# EAGLE design NESv2 (EAGLE 5.11)
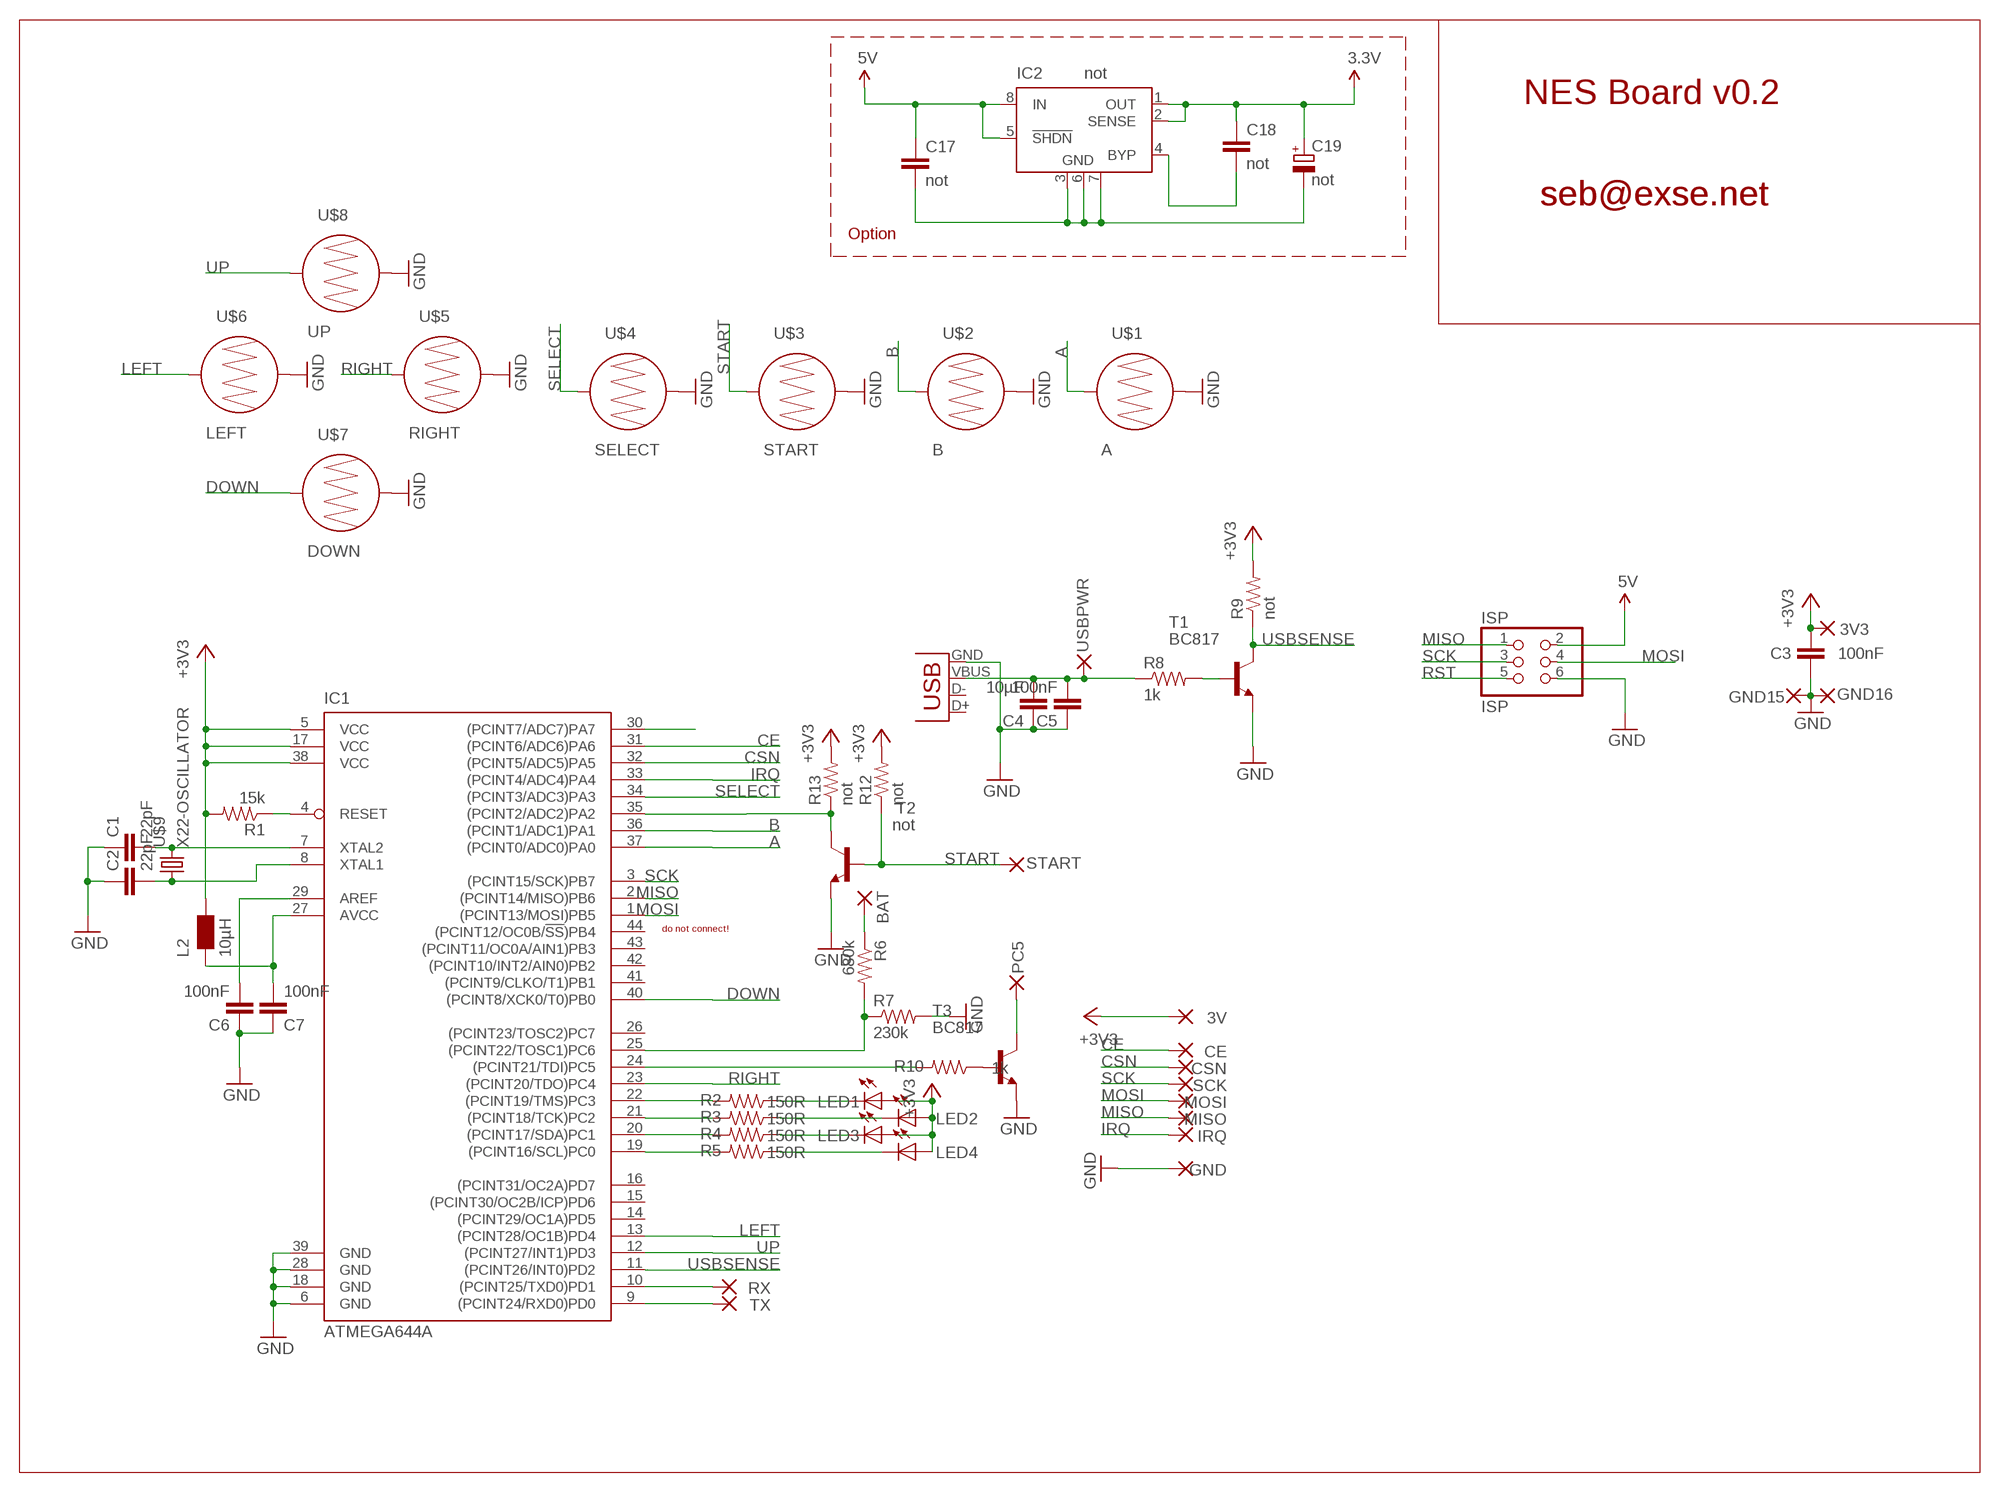
[diagram p0: schematic, sheet 1]

## Parts
3V  SMD2  [SMD1,27-2,54]
3V3  SMD2  [SMD1,27-2,54]
BAT  SMD2  [SMD1,27-2,54]
C1  22pF  CAP0805  [0805]
C2  22pF  CAP0805  [0805]
C3  100nF  CAP0805  [0805]
C4  10µF  CAP0805  [0805]
C5  100nF  CAP0805  [0805]
C6  100nF  CAP0805  [0805]
C7  100nF  CAP0805  [0805]
C17  not  CAP0805  [0805]
C18  not  CAP0805  [0805]
C19  not  CPOL-EUSMCC  [SMC_C]
CE  SMD2  [SMD1,27-2,54]
CSN  SMD2  [SMD1,27-2,54]
GND  SMD2  [SMD1,27-2,54]
GND15  SMD2  [SMD1,27-2,54]
GND16  SMD2  [SMD1,27-2,54]
IC1  ATMEGA644A  [TQFP44]
IC2  not  LT1763CS8-3.3  [SOIC8]
IRQ  SMD2  [SMD1,27-2,54]
ISP  ISP  PINHD-2X03_2.54  [2X03]
L2  10µH  WE-KIHQ_0805  [WE-KI_0805_B]
LED1  LED3MM  [LED3MM]
LED2  LED3MM  [LED3MM]
LED3  LED3MM  [LED3MM]
LED4  LED3MM  [LED3MM]
MISO  SMD2  [SMD1,27-2,54]
MOSI  SMD2  [SMD1,27-2,54]
PC5  SMD2  [SMD1,27-2,54]
R1  15k  RESISTOR  [0805]
R2  150R  RESISTOR  [0805]
R3  150R  RESISTOR  [0805]
R4  150R  RESISTOR  [0805]
R5  150R  RESISTOR  [0805]
R6  680k  RESISTOR  [0805]
R7  230k  RESISTOR  [0805]
R8  1k  RESISTOR  [0805]
R9  not  RESISTOR  [0805]
R10  1k  RESISTOR  [0805]
R12  not  RESISTOR  [0805]
R13  not  RESISTOR  [0805]
RX  SMD2  [SMD1,27-2,54]
SCK  SMD2  [SMD1,27-2,54]
START  SMD2  [SMD1,27-2,54]
T1  BC817  BC847  [SOT23]
T2  not  BC847  [SOT23]
T3  BC817  BC847  [SOT23]
TX  SMD2  [SMD1,27-2,54]
U$1  A  BUTTON-CONDUCTIVESMD  [BUTTON-CONDUCTIVE]
U$2  B  BUTTON-CONDUCTIVESMD  [BUTTON-CONDUCTIVE]
U$3  START  BUTTON-CONDUCTIVESMD  [BUTTON-CONDUCTIVE]
U$4  SELECT  BUTTON-CONDUCTIVESMD  [BUTTON-CONDUCTIVE]
U$5  RIGHT  BUTTON-CONDUCTIVESMD  [BUTTON-CONDUCTIVE]
U$6  LEFT  BUTTON-CONDUCTIVESMD  [BUTTON-CONDUCTIVE]
U$7  DOWN  BUTTON-CONDUCTIVESMD  [BUTTON-CONDUCTIVE]
U$8  UP  BUTTON-CONDUCTIVESMD  [BUTTON-CONDUCTIVE]
U$9  X22-OSCILLATOR  [X22]
USBPWR  SMD2  [SMD1,27-2,54]
X1  USB-SMD-NS  [USB-MINIB-NOSTOP]

## Nets
3.3V: C18.1 C19.+ IC2.1(OUT) IC2.2(SENSE)
5V: C17.1 IC2.5(!SHDN) IC2.8(IN) ISP.2
+3V3: 3V3.1(P) 3V.1(P) C3.1 IC1.5(VCC) IC1.17(VCC) IC1.38(VCC) L2.1 LED1.A LED2.A LED3.A LED4.A R1.2 R9.2 R12.2 R13.2
+5V: C4.2 C5.2 R8.1 USBPWR.1(P) X1.VBUS
A: IC1.37((PCINT0/ADC0)PA0) U$1.1
B: IC1.36((PCINT1/ADC1)PA1) U$2.1
CE: CE.1(P) IC1.31((PCINT6/ADC6)PA6)
CSN: CSN.1(P) IC1.32((PCINT5/ADC5)PA5)
DOWN: IC1.40((PCINT8/XCK0/T0)PB0) U$7.1
GND: C1.1 C2.1 C3.2 C4.1 C5.1 C6.2 C7.2 C17.2 C19.- GND15.1(P) GND16.1(P) GND.1(P) IC1.6(GND) IC1.18(GND) IC1.28(GND) IC1.39(GND) IC2.3(GND) IC2.6(GND) IC2.7(GND) ISP.6 R7.2 T1.2(E) T2.2(E) T3.2(E) U$1.2 U$2.2 U$3.2 U$4.2 U$5.2 U$6.2 U$7.2 U$8.2 X1.GND
IRQ: IC1.33((PCINT4/ADC4)PA4) IRQ.1(P)
LEFT: IC1.13((PCINT28/OC1B)PD4) U$6.1
MISO: IC1.2((PCINT14/MISO)PB6) ISP.1 MISO.1(P)
MOSI: IC1.1((PCINT13/MOSI)PB5) ISP.4 MOSI.1(P)
N$1: R10.1 T3.1(B)
N$2: C2.2 IC1.8(XTAL1) U$9.1
N$3: C1.2 IC1.7(XTAL2) U$9.3
N$4: IC1.19((PCINT16/SCL)PC0) R5.2
N$5: IC1.20((PCINT17/SDA)PC1) R4.2
N$6: IC1.21((PCINT18/TCK)PC2) R3.2
N$7: IC1.22((PCINT19/TMS)PC3) R2.2
N$8: LED1.K(C) R2.1
N$9: LED2.K(C) R3.1
N$10: LED3.K(C) R4.1
N$11: LED4.K(C) R5.1
N$12: IC1.24((PCINT21/TDI)PC5) R10.2
N$13: C7.1 IC1.27(AVCC) L2.2
N$14: IC1.9((PCINT24/RXD0)PD0) TX.1(P)
N$15: IC1.10((PCINT25/TXD0)PD1) RX.1(P)
N$16: BAT.1(P) R6.1
N$17: IC1.25((PCINT22/TOSC1)PC6) R6.2 R7.1
N$18: R8.2 T1.1(B)
N$19: C18.2 IC2.4(BYP)
N$20: C6.1 IC1.29(AREF)
N$21: IC1.35((PCINT2/ADC2)PA2) R13.1 T2.3(C)
N$22: IC1.30((PCINT7/ADC7)PA7)
PC5: PC5.1(P) T3.3(C)
RIGHT: IC1.23((PCINT20/TDO)PC4) U$5.1
RST: IC1.4(RESET) ISP.5 R1.1
SCK: IC1.3((PCINT15/SCK)PB7) ISP.3 SCK.1(P)
SELECT: IC1.34((PCINT3/ADC3)PA3) U$4.1
START: R12.1 START.1(P) T2.1(B) U$3.1
UP: IC1.12((PCINT27/INT1)PD3) U$8.1
USBSENSE: IC1.11((PCINT26/INT0)PD2) R9.1 T1.3(C)
Unconnected: IC1.14((PCINT29/OC1A)PD5) IC1.15((PCINT30/OC2B/ICP)PD6) IC1.16((PCINT31/OC2A)PD7) IC1.26((PCINT23/TOSC2)PC7) IC1.41((PCINT9/CLKO/T1)PB1) IC1.42((PCINT10/INT2/AIN0)PB2) IC1.43((PCINT11/OC0A/AIN1)PB3) IC1.44((PCINT12/OC0B/!SS!)PB4) X1.D+ X1.D-

## Notes on the sheet
- NES Board v0.2
- seb@exse.net | seb@exse.net
- Option
- do not connect!

## Library data of the parts
3V 3V3 BAT CE CSN GND GND15 GND16 IRQ MISO MOSI PC5 RX SCK START TX USBPWR = wirepad:SMD2: SMD PAD
C1-C7 C17 C18 = SparkFun:CAP: Capacitor Standard 0603 ceramic capacitor, and 0.1" leaded capacitor.
C19 = resistor:CPOL-EU: POLARIZED CAPACITOR, European symbol
IC1 = atmel:ATMEGA644: 8-bit Microcontroller with 64K Bytes In-System Programmable Flash Source: http://www.atmel.com/dyn/resources/prod_documents/doc2593.pdf; MPN: ATMEGA644PV-10AU; OC_FARNELL: 1455123; OC_NEWARK: 58M3748
IC2 = linear-technology:LT1763CS8: 500mA, Low Noise, LDO Micropower Regulators Source: http://cds.linear.com/docs/Datasheet/1763ff.pdf
ISP = pinhead-2:PINHD-2X03: PIN HEADER
L2 = wuerth-elektronik:WE-KIHQ: SMD Wire Wound Ceramic Inductor WE-KIHQ - High current - Highest Quality factor in size 0805 - up to 98 - High thermal stability - High SRF -- Bluetooth -- Wireless LAN -- RF oscillation circuit -- IF impedance matching -- IG choke
LED1-LED4 = SparkFun:LED: LEDs Standard schematic elements and footprints for 5mm, 3mm, 1206, and 0603 sized LEDs. 5mm - Spark Fun Electronics SKU : COM-00529 (and others)
R1-R10 R12 R13 = SparkFun:RESISTOR: Resistor Basic schematic elements and footprints for 0603, 1206, and PTH 1/10th watt (small) resistors.
T1-T3 = transistor:BC847: NPN TRANSISTOR
U$1-U$8 = SparkFun:BUTTON-CONDUCTIVE: Conductive Button Used with rubber key pads. This one was designed and proven to work with the PolyCase Key FOB enclosures.
U$9 = seb:X22-OSCILLATOR
X1 = SparkFun:USB: USB Connectors USB-B-PTH is fully proven SKU : PRT-00139 USB-miniB is fully proven SKU : PRT-00587 USB-A-PCB is untested. USB-A-H is throughly reviewed, but untested. Spark Fun Electronics SKU : PRT-00437 USB-B-SMT is throughly reviewed, but untested. Needs silkscreen touching up. USB-A-S has not been used/tested USB-MB-H has not been used/tested

## Board
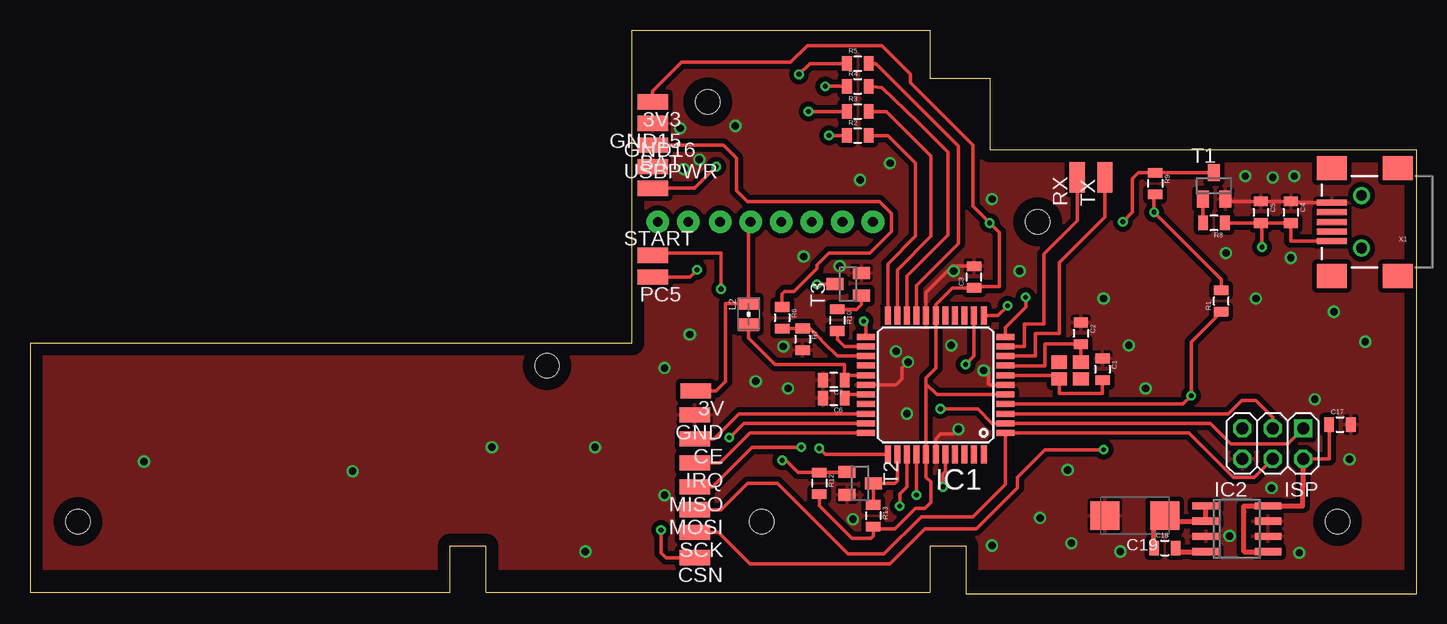
[diagram p1: board, top side]
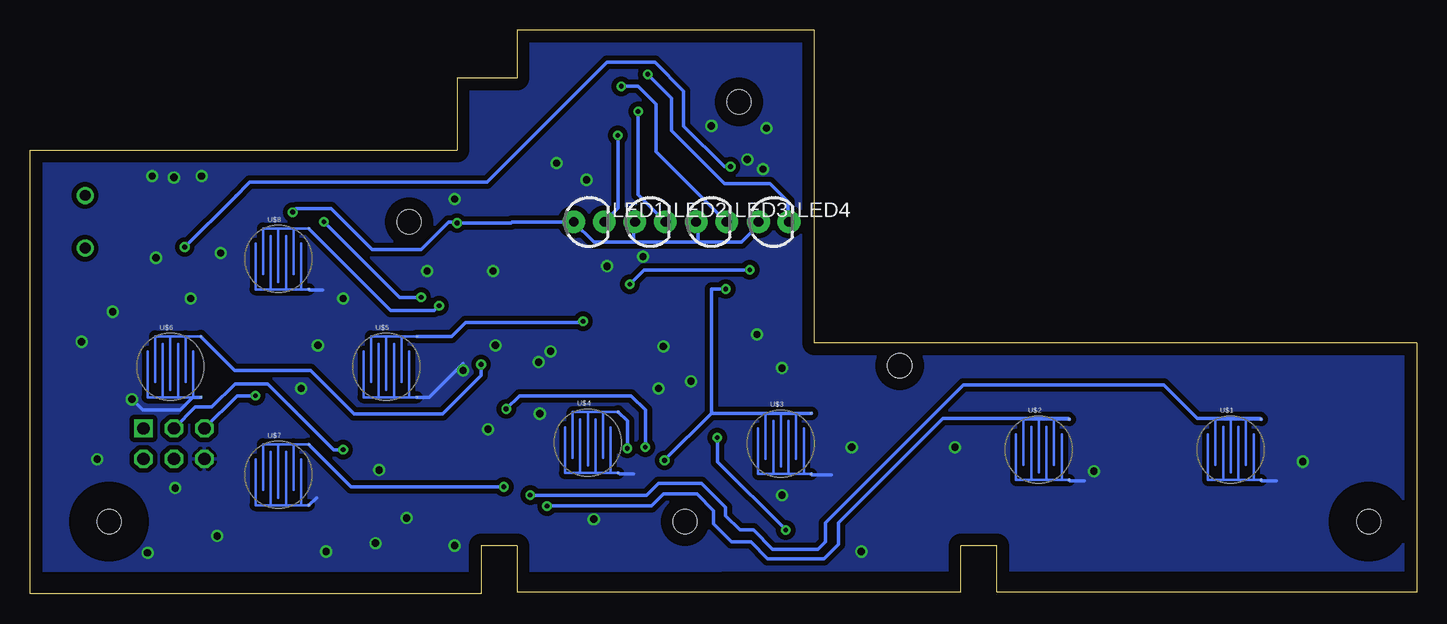
[diagram p2: board, bottom side, seen from below]

Size 115.6 x 47 mm. Coordinates in mm from the lower left corner, seen from the top.
Outline: 0,0.1 35,0.1 35,4 38,4 38,0.1 75,0.1 75,4 78,4 78,0 115.6,0 115.6,37 80,37 80,43 75,43 75,47 50.2,47 50.2,20.9 0,20.9 0,0.1
Copper layers (1*16): Top 0.035mm / dielectric 1.5mm / Bottom 0.035mm
Design rules "default *": minimum track width 10mil, minimum drill 0.3mm, track to track 8mil, track to pad 8mil, pad to pad 8mil, via to via 8mil, smd to smd 8mil, copper to edge 40mil, drill to drill 8mil, minimum pad ring 10mil, minimum via ring 8mil, stop-mask expansion 4mil, vias tented up to drill 0.6mm, thermal gap 10mil
Holes 2 mm at 4,6 61,6 109,6 56.5,41 84,31 43.1,19
tKeepout: area 91.3,15.9 to 97.3,21.9; area 19.6,11 to 25.6,17
bKeepout: area 59.6,4.6 to 62.4,7.4; area 55.1,39.6 to 57.9,42.4; area 41.7,17.7 to 44.5,20.5; area 82.4,29.5 to 85.2,32.3
tRestrict: 3 lines
bRestrict: area 107.6,4.6 to 110.4,7.4; area 2.6,4.6 to 5.4,7.4

### Footprints (pad centres in the part's own frame; a part is rotated, then mirrored left to right if it is on the bottom)
SMD1,27-2,54 = smd 1.27 x 2.54: 1 0,0
0805 = smd 0.8 x 1.2: 1 -0.9,0; 2 0.9,0
SMC_C = smd 2.4 x 2.4: + -2.5,0; - 2.5,0
TQFP44 = smd 1.5 x 0.5: 1 -5.8,4; 2 -5.8,3.2; 3 -5.8,2.4; 4 -5.8,1.6; 5 -5.8,0.8; 6 -5.8,0; 7 -5.8,-0.8; 8 -5.8,-1.6; 9 -5.8,-2.4; 10 -5.8,-3.2; 11 -5.8,-4; 23 5.8,-4; 24 5.8,-3.2; 25 5.8,-2.4; 26 5.8,-1.6; 27 5.8,-0.8; 28 5.8,0; 29 5.8,0.8; 30 5.8,1.6; 31 5.8,2.4; 32 5.8,3.2; 33 5.8,4 | smd 0.5 x 1.5: 12 -4,-5.8; 13 -3.2,-5.8; 14 -2.4,-5.8; 15 -1.6,-5.8; 16 -0.8,-5.8; 17 0,-5.8; 18 0.8,-5.8; 19 1.6,-5.8; 20 2.4,-5.8; 21 3.2,-5.8; 22 4,-5.8; 34 4,5.8; 35 3.2,5.8; 36 2.4,5.8; 37 1.6,5.8; 38 0.8,5.8; 39 0,5.8; 40 -0.8,5.8; 41 -1.6,5.8; 42 -2.4,5.8; 43 -3.2,5.8; 44 -4,5.8
SOIC8 = smd 0.6 x 2.2: 1 -1.905,-2.6; 2 -0.635,-2.6; 3 0.635,-2.6; 4 1.905,-2.6; 5 1.905,2.6; 6 0.635,2.6; 7 -0.635,2.6; 8 -1.905,2.6
2X03 = drill 1.016 square: 1 -2.54,-1.27 | drill 1.016 octagon: 2 -2.54,1.27; 3 0,-1.27; 4 0,1.27; 5 2.54,-1.27; 6 2.54,1.27
WE-KI_0805_B = smd 1.02 x 1.78: 1 -0.89,0; 2 0.89,0
LED3MM = drill 0.813 pad 1.88 round: A -1.27,0; K 1.27,0
SOT23 = smd 1 x 1.4: 1 -0.95,-1.1; 2 0.95,-1.1; 3 0,1.1
BUTTON-CONDUCTIVE = smd 0.203 x 0.203: 1 2.54,2.54; 2 2.54,-2.54
X22 = smd 1.3 x 1.1: 1 0.9,0.7; 2 -0.9,0.7; 3 -0.9,-0.7; 4 0.9,-0.7
USB-MINIB-NOSTOP = smd 2.5 x 0.5: D+ 2.5,0; D- 2.5,0.8; GND 2.5,-1.6; ID 2.5,-0.8; VBUS 2.5,1.6 | smd 2.5 x 2: G1 -3,-4.5; G2 -3,4.5; G3 2.5,4.5; G4 2.5,-4.5 | drill 0.9 pad 0.8 round: H1 0,2.2 | drill 0.9 pad 0.787 round: H2 0,-2.2

### Placement (x,y rotation side)
3V  55.5,16.9 90 top
3V3  51.9,41 90 top
BAT  51.9,37.4 90 top
C1  89.4,18.7 270 top
C2  87.6,21.7 270 top
C3  78.7,26.4 90 top
C4  105.1,31.8 270 top
C5  102.6,31.8 270 top
C6  67,16.3 180 top
C7  67,17.8 180 top
C17  109.2,14.1 0 top
C18  94.6,3.8 0 top
C19  92.1,6.5 180 top
CE  55.4,12.9 90 top
CSN  55.4,3 90 top
GND  55.4,14.9 90 top
GND15  51.9,39.2 90 top
GND16  51.9,35.6 270 top
IC1  75.5,17.4 180 top
IC2  100.6,5.4 270 top
IRQ  55.4,10.9 90 top
ISP  103.6,12.5 180 top
L2  59.9,23.3 270 top
LED1  69,31 0 bottom
LED2  63.9,31 0 bottom
LED3  58.8,31 0 bottom
LED4  53.6,31 0 bottom
MISO  55.4,8.9 90 top
MOSI  55.4,7 90 top
PC5  51.9,26.4 90 top
R1  99.3,24.4 90 top
R2  69,38.2 0 top
R3  69,40.2 0 top
R4  69,42.3 0 top
R5  69,44.2 0 top
R6  62.7,23 270 top
R7  64.4,21.2 270 top
R8  98.7,30.9 180 top
R9  93.8,34.2 270 top
R10  67.3,22.8 270 top
R12  65.8,9.2 270 top
R13  70.3,6.5 270 top
RX  87.3,34.7 0 top
SCK  55.4,5.1 90 top
START  51.9,28.2 270 top
T1  98.7,34 0 top
T2  69.2,9.2 270 top
T3  68.2,25.8 90 top
TX  89.6,34.7 0 top
U$1  15.5,12 0 bottom
U$2  31.5,12 0 bottom
U$3  53,12.5 0 bottom
U$4  69.1,12.6 0 bottom
U$5  85.9,18.9 0 bottom
U$6  103.9,18.9 0 bottom
U$7  94.9,9.9 0 bottom
U$8  94.9,27.9 0 bottom
U$9  86.7,18.6 0 top
USBPWR  51.9,33.8 270 top
X1  111,31 180 top

### Tracks (layer width: path | path; a pad name or v marks a point on that pad's centre or on a via)
3.3V
  Top 0.406: IC2.1 IC2.2 94.6,6.03 C19.+ 93.7,6.5 C18.1
5V
  Top 0.305: C17.1 108.3,11.23 ISP.2
  Top 0.406: ISP.2 106.14,8.9 106.1,8.9 106.1,7.3 103.7,7.3 | 103.7,7.3 IC2.8 | IC2.5 101.2,3.5 101.2,6.8 101.2,7.3 103.7,7.3
+3V3  (via drill 0.4)
  Top 0.305: LED3.A 59.9,30.83 L2.1 57.99,24.19 57.99,17.69 57.2,16.9 3V.1 | 74.7,17.5 IC1.38 74.7,9.7 75.1,9.3 75.1,7.6 74.6,7.1 73.8,7.1 72.1,5.4 70.6,5.4 70.2,5.8 R13.2 70.3,4.8 70.1,4.6 68.5,4.6 65.8,7.3 R12.2 | 74.7,17.5 74.7,18 75.5,18.8 IC1.17 75.5,24.1 76.9,25.5 C3.1 78.8,25.6 80.8,25.6 80.8,30.1 v80,30.9 78.6,32.3 78.6,37.4 73.4,42.6 73.4,43.3 71,45.7 64.8,45.7 63.4,44.3 54.3,44.3 51.9,41.9 3V3.1 | IC1.5 75.6,16.6 74.7,17.5 | R9.2 93.7,33.2 v93.7,31.8 99.3,26.2 R1.2
  Bottom 0.305: 65.3,29.3 68.57,29.3 LED1.A 75.4,31 75.5,30.9 v80,30.9 80,31 80.7,31 83,28.7 87.1,28.7 90.5,32.1 93.4,32.1 v93.7,31.8 | 59.9,29.3 65.3,29.3 | 59.9,29.3 56.3,29.3 54.87,30.73 LED4.A | LED3.A 59.9,30.83 59.9,29.3 | LED2.A 65.3,30.87 65.3,29.3
+5V  (via drill 0.4)
  Top 0.305: C5.2 C4.2 105.1,29.4 X1.VBUS | C5.2 R8.1 | v102.7,28.9 102.7,30.8 C5.2 | USBPWR.1 55.4,33.8 v57.2,35.6
  Bottom 0.305: 98.6,33 v102.7,28.9 | 98.6,33 98.4,33.2 | 98.6,33 97.3,34.3 77.5,34.3 67.5,44.3 63.5,44.3 61.1,41.9 61.1,39 57.7,35.6 v57.2,35.6
A  (via drill 0.4)
  Top 0.305: v73.9,8.2 IC1.37
  Bottom 0.305: U$1.1 13.02,14.6 18.3,14.6 21.1,17.4 37.8,17.4 49.3,5.9 49.3,4.3 49.9,3.7 53.7,3.7 55.3,5.3 56.4,5.3 57.6,6.5 57.6,7.2 59.6,9.2 63.2,9.2 64.2,8.2 v73.9,8.2
B  (via drill 0.4)
  Top 0.305: IC1.36 73.1,8.9 72.5,8.3 v72.5,7.3
  Bottom 0.305: U$2.1 29.02,14.6 34.8,14.6 | 34.8,14.6 35,14.6 | v72.5,7.3 72.2,7.3 63.8,7.3 62.8,8.3 60,8.3 58.6,6.9 58.6,5.8 57.1,4.3 56.5,4.3 55.5,4.3 54.1,2.9 49.4,2.9 48.2,4.1 48.2,5.9 39.7,14.4 39.5,14.6 34.8,14.6
CE
  Top 0.305: IC1.31 59.1,15 57,12.9 CE.1
CSN  (via drill 0.4)
  Top 0.305: IC1.32 59.5,14.2 v58.3,13 | v52.6,5.3 52.6,3.4 53,3 CSN.1
  Bottom 0.305: v58.3,13 58.3,11 v52.6,5.3
DOWN  (via drill 0.4)
  Top 0.305: v76.1,8.9 76.1,10 76.3,10.2 IC1.40
  Bottom 0.305: U$7.1 92.32,12.4 88.82,8.9 v76.1,8.9
GND  (via drill 0.6)
  Top 0.305: X1.GND 105.1,32.6 C4.1 C5.1 99.65,32.7 T1.2 | 69.6,17.4 IC1.28 72.2,17.4 72.7,17.9 72.7,18.8 v73.2,19.3 | IC1.18 74.7,25.1 76.9,27.3 C3.2 | IC1.6 80,17.4 79.9,17.5 79.9,18.8 | IC1.39 75.5,12.9 75.9,13.3 77,13.3 v77.4,13.7
  Bottom 0.305: U$7.2 91.72,8 91.7,8 | U$8.2 92.3,25.3 91.2,25.3 | U$4.2 66.42,10 65.3,10 | U$3.2 50.4,9.9 48.8,9.9 | U$2.2 28.9,9.4 27.7,9.4 | U$1.2 12.9,9.4 11.7,9.4 | U$5.2 82.34,16.36 79.5,19.2 | U$6.2 102.04,16.36 103.1,15.3 106.2,15.3 v107.1,16.2
  other vias: 52.9,8.2 100,4.8 103.6,34.7 76.8,20.7 86.5,10.3 72.2,20.2 103.5,8.8 54.5,35.4 101.3,34.8 105.4,34.8 111.3,21 108.7,23.5 77,26.9 90.9,3.5 68.6,6.2 73.1,15 82.5,26.9 64.5,28.1 9.5,11 80.2,4 105.8,3.4 99.7,28.4 105.1,28 91.6,20.7 58.8,39 47.1,12.2 84.2,6.3 93,17.1 46.3,3.5 86.8,4.2 110,11.2 55,21.6 89.5,24.6 26.9,10.2 67.5,27.3 60.5,17.7 63.2,17.1 38.5,12.2 52.9,18.8 102.2,24.6 54.2,38.8 55.8,36.2 71.7,35.9 62.8,20.6 80.2,32.9 69.2,34.5 79.5,18.6
  pour Top (isolate 0.4): 115.9,2.1 115.8,47.1 -0.1,47.1 0,2.1
  pour Bottom (isolate 0.4): 115.9,1.9 115.6,47.2 -0.3,47.3 0,2
IRQ
  Top 0.305: IC1.33 60,13.4 57.5,10.9 IRQ.1
LEFT  (via drill 0.4)
  Top 0.305: v78,19.1 78.7,19.8 IC1.13
  Bottom 0.305: v78,19.1 78,18.2 81.2,15 88.6,15 92.2,18.6 98.52,18.6 U$6.1
MISO  (via drill 0.4)
  Top 0.305: ISP.1 104.87,12.5 100.1,12.5 98.4,14.2 IC1.2 80.2,14.2 79,15.4 v75.9,15.4 | v64.3,12.2 60.2,12.2 56.9,8.9 MISO.1
  Bottom 0.305: v64.3,12.2 64.3,15.3 65.5,16.5 74.8,16.5 v75.9,15.4
MOSI
  Top 0.305: ISP.4 102.07,9.7 100.3,9.7 96.6,13.4 IC1.1 81.3,9.1 78.6,6.4 74.3,6.4 71.2,3.3 68.2,3.3 62.3,9.2 59.8,9.2 57.6,7 MOSI.1
N$1
  Top 0.305: R10.1 68.9,23.7 69.3,24.1 T3.1
N$2
  Top 0.305: IC1.8 84.6,19 84.6,20.8 C2.2 U$9.1
N$3
  Top 0.305: IC1.7 85.6,18.2 U$9.3 85.8,16.7 89.4,16.7 C1.2
N$4
  Top 0.305: R5.2 70.5,44.2 74,40.7 77.4,37.3 77.4,29.2 73.9,25.7 IC1.19
N$5
  Top 0.305: R4.2 71,42.2 74,39.3 76.5,36.8 76.5,29.9 73.1,26.5 IC1.20
N$6
  Top 0.305: IC1.21 72.3,27 75.1,29.8 75.1,36.5 71.7,39.9 71.4,40.2 R3.2
N$7
  Top 0.305: IC1.22 71.5,27.5 73.8,29.8 73.8,35.9 72.1,37.6 71.5,38.2 R2.2
N$8  (via drill 0.4)
  Top 0.305: v66.6,38.2 R2.1
  Bottom 0.305: LED1.K 66.6,32.13 v66.6,38.2
N$9  (via drill 0.4)
  Top 0.305: v64.9,40.2 R3.1
  Bottom 0.305: LED2.K 64.9,33.27 v64.9,40.2
N$10  (via drill 0.4)
  Top 0.305: v66.3,42.3 R4.1
  Bottom 0.305: LED3.K 63.4,36.87 63.4,40.8 64.9,42.3 v66.3,42.3
N$11  (via drill 0.4)
  Top 0.305: R5.1 65,44.2 v64.1,43.3
  Bottom 0.305: LED4.K 52.4,31.07 52.4,32.7 53.9,34.2 57.7,34.2 62.1,38.6 62.1,41.3 64,43.2 v64.1,43.3
N$12
  Top 0.305: IC1.24 67.9,20.6 67.3,21.2 R10.2
N$13
  Top 0.305: C7.1 68.2,18.2 IC1.27 67.9,18.2 67.9,17.7 67.9,19.1 64.7,19.1 62.1,19.1 60.3,20.9 59.9,21.3 L2.2
N$14
  Top 0.305: IC1.9 83.8,19.8 83.8,21.7 85.8,21.7 85.8,22.4 85.8,27.6 89.1,30.9 89.6,31.4 TX.1
N$15
  Top 0.305: IC1.10 82.9,20.6 82.9,22.5 84.5,22.5 84.5,24 84.5,28.3 87.1,30.9 87.3,31.1 RX.1
N$16
  Top 0.305: R6.1 62.7,25 62.9,25.2 63.7,25.2 65.6,27.1 65.6,27.4 66.6,28.4 70,28.4 71.8,30.2 71.8,31.7 70.8,32.7 59.8,32.7 58.9,33.6 58.9,36.3 57.8,37.4 BAT.1
N$17
  Top 0.305: R6.2 R7.1 65,22.1 65.8,21.3 66.2,20.9 67.3,19.8 IC1.25
N$18
  Top 0.305: R8.2 97.75,30.5 T1.1
N$19
  Top 0.406: IC2.4 95.5,3.5 C18.2
N$20
  Top 0.305: IC1.29 68.2,16.6 C6.1
N$21
  Top 0.305: IC1.35 72.3,9.4 72.1,9.2 T2.3 R13.1
PC5  (via drill 0.4)
  Top 0.305: v55.6,27 55,26.4 PC5.1 | v65.6,25.8 T3.3
  Bottom 0.305: v55.6,27 64.4,27 v65.6,25.8
RIGHT  (via drill 0.4)
  Top 0.305: v69.5,22.7 69.7,22.5 IC1.23
  Bottom 0.305: U$5.1 80.46,21.44 79.3,22.6 69.6,22.6 v69.5,22.7
RST  (via drill 0.4)
  Top 0.305: IC1.4 96.1,15.8 v96.8,16.5 | v96.8,16.5 96.8,17.9 | R1.1 96.8,21 v96.8,16.5
  Bottom 0.305: v96.8,16.5 98.33,16.5 ISP.5
SCK  (via drill 0.4)
  Top 0.305: ISP.3 103.6,14.7 102.2,16.1 101,16.1 99.9,15 IC1.3 | v89.5,12 84.6,12 82.3,9.7 82.3,8.8 78.9,5.4 74.6,5.4 71.7,2.5 60,2.5 57.4,5.1 SCK.1
  Bottom 0.305: v89.5,12 90.3,12 95.8,17.5 98.5,17.5 100.45,15.55 101.82,15.55 ISP.3
SELECT  (via drill 0.4)
  Top 0.305: IC1.34 66.3,11.6 v65.8,12.1
  Bottom 0.305: v65.8,12.1 65.8,14.38 U$4.1
START  (via drill 0.4)
  Top 0.305: v57.6,25.4 57.6,28.4 52.5,28.4 START.1 | v62.7,11.1 63,11.1 64,10.1 R12.1 67.95,10.1 T2.1
  Bottom 0.305: v62.7,11.1 62.7,11.14 58.8,15.04 | U$3.1 58.8,15.04 | v57.6,25.4 58.8,25.4 58.8,15.04
UP  (via drill 0.4)
  Top 0.305: IC1.12 80.7,23.2 v81.5,24
  Bottom 0.305: U$8.1 85.52,23.6 81.9,23.6 v81.5,24
USBSENSE  (via drill 0.4)
  Top 0.305: v91.1,31 91.9,31.8 91.9,34.6 92.4,35.1 R9.1 T1.3 | IC1.11 81.3,22.2 82.3,23.2 83,23.9 v83,24.7
  Bottom 0.305: v83,24.7 84.8,24.7 v91.1,31

### Text on the board
tValues: 4148 | 1M_TO_GND | 1M_TO_GND | cut | add wire | 4148
tStop: 3V3 | GND | BAT | GND | USB5V | ON | OFF | PentaWall GamePad v0.2 | 3V | seb@exse.net | GND | CE | IRQ | MISO | MOSI | SCK | <<</>> | CSN
bStop: seb@exse.net | <<</>>